# Altium schematic sheet DC_DC_15V_AND_VAR.SchDoc
size Tabloid; Date: Date; Author: Author 1; DocumentNumber: 6; Revision: 1; SheetNumber: 6; SheetTotal: 7; Size: 11x17; Sheet_Name: 15V and Variable V
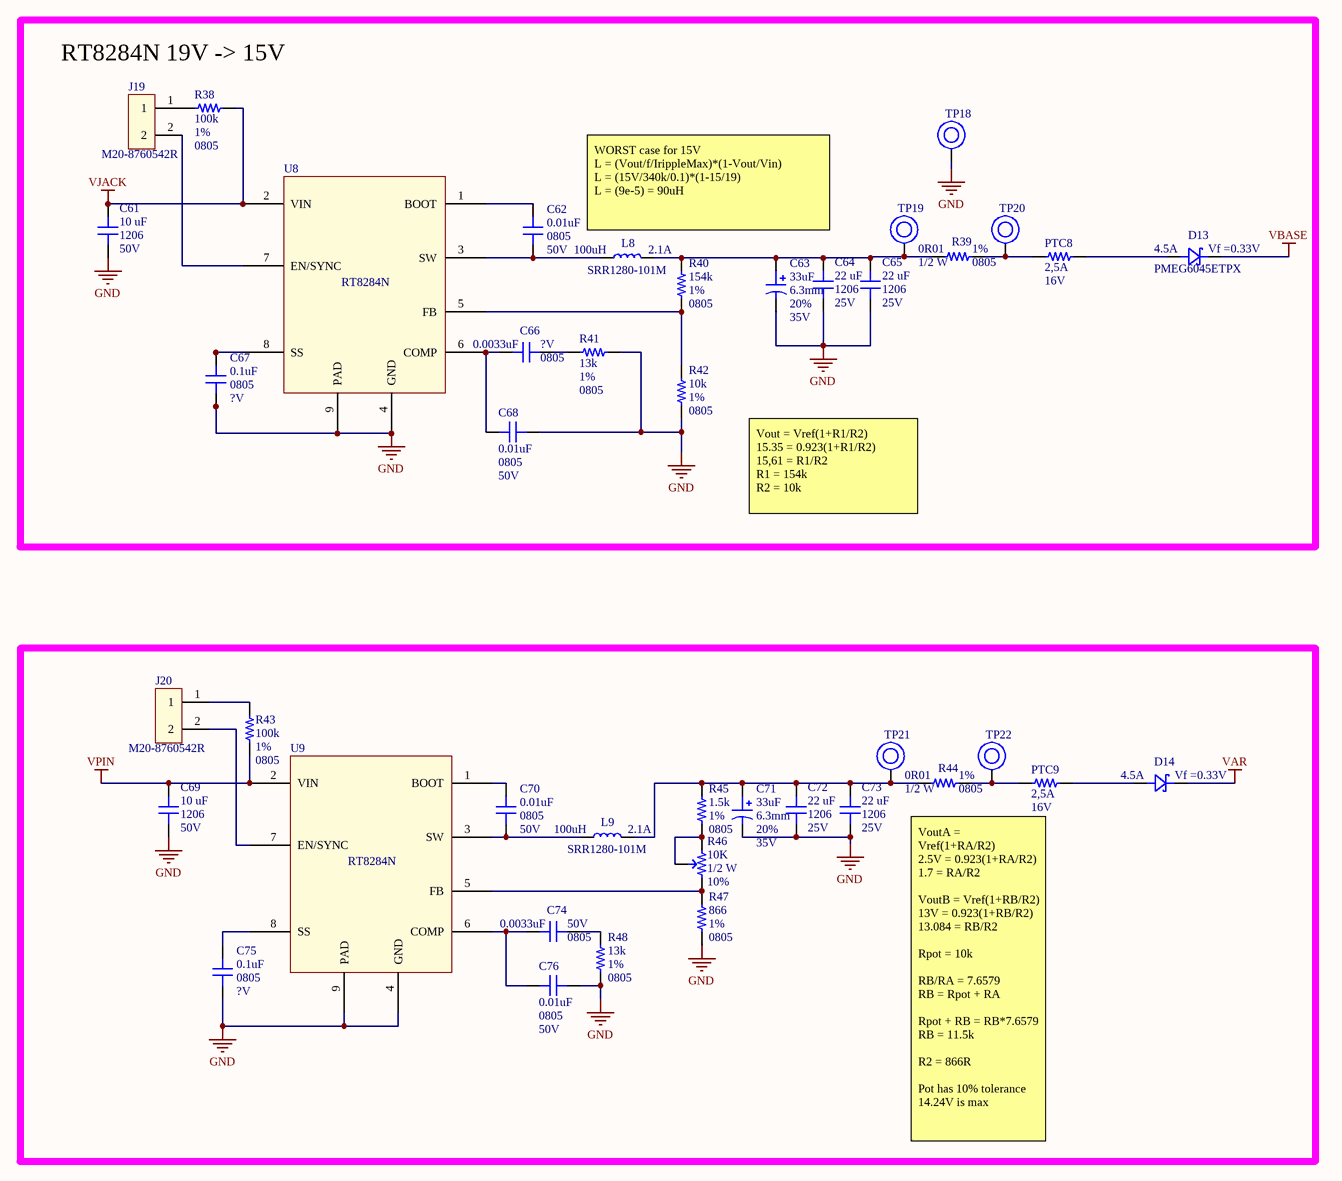
[diagram p0: DC_DC_15V_AND_VAR.SchDoc]

## Parts
C61  value 10 uF  Package: 1206  Voltage: 50V  [CAP_1206]  (hidden comment: CAP - 1206)
C62  value 0.01uF  Package: 0805  Voltage: 50V  [CAP_0805]  (hidden comment: CAP - 0805)
C63  value 33uF  Package: 6.3mm  Tolerance: 20%  Voltage: 35V  [CAP ALU - 6.3mm DIA]  (hidden comment: CAP ALU - 6.3mm)
C64  value 22 uF  Package: 1206  Voltage: 25V  [CAP_1206]  (hidden comment: CAP - 1206)
C65  value 22 uF  Package: 1206  Voltage: 25V  [CAP_1206]  (hidden comment: CAP - 1206)
C66  value 0.0033uF  Package: 0805  Voltage: ?V  [CAP_0805]  (hidden comment: CAP - 0805)
C67  value 0.1uF  Package: 0805  Voltage: ?V  [CAP_0805]  (hidden comment: CAP - 0805)
C68  value 0.01uF  Package: 0805  Voltage: 50V  [CAP_0805]  (hidden comment: CAP - 0805)
C69  value 10 uF  Package: 1206  Voltage: 50V  [CAP_1206]  (hidden comment: CAP - 1206)
C70  value 0.01uF  Package: 0805  Voltage: 50V  [CAP_0805]  (hidden comment: CAP - 0805)
C71  value 33uF  Package: 6.3mm  Tolerance: 20%  Voltage: 35V  [CAP ALU - 6.3mm DIA]  (hidden comment: CAP ALU - 6.3mm)
C72  value 22 uF  Package: 1206  Voltage: 25V  [CAP_1206]  (hidden comment: CAP - 1206)
C73  value 22 uF  Package: 1206  Voltage: 25V  [CAP_1206]  (hidden comment: CAP - 1206)
C74  value 0.0033uF  Package: 0805  Voltage: 50V  [CAP_0805]  (hidden comment: CAP - 0805)
C75  value 0.1uF  Package: 0805  Voltage: ?V  [CAP_0805]  (hidden comment: CAP - 0805)
C76  value 0.01uF  Package: 0805  Voltage: 50V  [CAP_0805]  (hidden comment: CAP - 0805)
D13  Current: 4.5A  Vf: Vf =0.33V  Part number: PMEG6045ETPX  [DO-214AC_SOD128]  (hidden comment: SCHOTTKEY)
D14  Current: 4.5A  Vf: Vf =0.33V  [DO-214AC_SOD128]  (hidden comment: SCHOTTKEY)
J19  Part number: M20-8760542R  [HDR1X2]  (hidden comment: Header 2 pin SM)
J20  Part number: M20-8760542R  [HDR1X2]  (hidden comment: Header 2 pin SM)
L8  value 100uH  Current: 2.1A  Part number: SRR1280-101M  [BOURNS 12.5x12.5mm]  (hidden comment: IND)
L9  value 100uH  Current: 2.1A  Part number: SRR1280-101M  [BOURNS 12.5x12.5mm]  (hidden comment: IND)
PTC8  Trip value: 2,5A  Voltage: 16V  [PTC - 1812]  (hidden comment: PTC - 1812)
PTC9  Trip value: 2,5A  Voltage: 16V  [PTC - 1812]  (hidden comment: PTC - 1812)
R38  value 100k  Tolerance: 1%  Package: 0805  [FER_0805]  (hidden comment: RES - 0805)
R39  value 0R01  Watt: 1/2 W  Tolerance: 1%  Package: 0805  [FER_0805]  (hidden comment: RES - 0805)
R40  value 154k  Tolerance: 1%  Package: 0805  [FER_0805]  (hidden comment: RES - 0805)
R41  value 13k  Tolerance: 1%  Package: 0805  [FER_0805]  (hidden comment: RES - 0805)
R42  value 10k  Tolerance: 1%  Package: 0805  [FER_0805]  (hidden comment: RES - 0805)
R43  value 100k  Tolerance: 1%  Package: 0805  [FER_0805]  (hidden comment: RES - 0805)
R44  value 0R01  Watt: 1/2 W  Tolerance: 1%  Package: 0805  [FER_0805]  (hidden comment: RES - 0805)
R45  value 1.5k  Tolerance: 1%  Package: 0805  [FER_0805]  (hidden comment: RES - 0805)
R46  value 10K  Watt: 1/2 W  Tolerance: 10%  [3361P]  (hidden comment: Pot)
R47  value 866  Tolerance: 1%  Package: 0805  [FER_0805]  (hidden comment: RES - 0805)
R48  value 13k  Tolerance: 1%  Package: 0805  [FER_0805]  (hidden comment: RES - 0805)
TP18  TestPoint 3x3mm  [TestPoint 3X3mm]  (value not drawn)
TP19  TestPoint 3x3mm  [TestPoint 3X3mm]  (value not drawn)
TP20  TestPoint 3x3mm  [TestPoint 3X3mm]  (value not drawn)
TP21  TestPoint 3x3mm  [TestPoint 3X3mm]  (value not drawn)
TP22  TestPoint 3x3mm  [TestPoint 3X3mm]  (value not drawn)
U8  RT8284N  [SOP8]  (value not drawn)
U9  RT8284N  [SOP8]  (value not drawn)

## Blocks framed on the sheet
RT8284N 19V -> 15V: C61-C68 D13 J19 L8 PTC8 R38-R42 TP18-TP20 U8

## Nets
GND: C61.2 C63.2 C64.2 C65.2 C67.2 C68.2 C69.2 C71.2 C72.2 C73.2 C75.2 C76.2 R41.2 R42.2 R47.2 R48.1 TP18.1 U8.4(GND) U8.9(PAD) U9.4(GND) U9.9(PAD)
VAR: D14.2
VBASE: D13.2
VJACK: C61.1 R38.2 U8.2(VIN)
VPIN: C69.1 R43.1 U9.2(VIN)
NetC62_1: C62.1 U8.1(BOOT)
NetC62_2: C62.2 L8.1 U8.3(SW)
NetC63_1: C63.1 C64.1 C65.1 L8.2 R39.1 R40.1 TP19.1
NetC66_1: C66.1 C68.1 U8.6(COMP)
NetC66_2: C66.2 R41.1
NetC67_1: C67.1 U8.8(SS)
NetC70_1: C70.1 U9.1(BOOT)
NetC70_2: C70.2 L9.1 U9.3(SW)
NetC71_1: C71.1 C72.1 C73.1 L9.2 R44.1 R45.1 TP21.1
NetC74_1: C74.1 C76.1 U9.6(COMP)
NetC74_2: C74.2 R48.2
NetC75_1: C75.1 U9.8(SS)
NetD13_1: D13.1 PTC8.2
NetD14_1: D14.1 PTC9.2
NetJ19_1: J19.1 R38.1
NetJ19_2: J19.2 U8.7(EN/SYNC)
NetJ20_1: J20.1 R43.2
NetJ20_2: J20.2 U9.7(EN/SYNC)
NetPTC8_1: PTC8.1 R39.2 TP20.1
NetPTC9_1: PTC9.1 R44.2 TP22.1
NetR40_2: R40.2 R42.1 U8.5(FB)
NetR45_2: R45.2 R46.1 R46.3
NetR46_2: R46.2 R47.1 U9.5(FB)

## Notes on the sheet
- WORST case for 15V
  L = (Vout/f/IrippleMax)*(1-Vout/Vin)
  L = (15V/340k/0.1)*(1-15/19)
  L = (9e-5) = 90uH
- Vout = Vref(1+R1/R2)
  15.35 = 0.923(1+R1/R2)
  15,61 = R1/R2
  R1 = 154k
  R2 = 10k
- VoutA = Vref(1+RA/R2)
  2.5V = 0.923(1+RA/R2)
  1.7 = RA/R2
  VoutB = Vref(1+RB/R2)
  13V = 0.923(1+RB/R2)
  13.084 = RB/R2
  Rpot = 10k
  RB/RA = 7.6579
  RB = Rpot + RA
  Rpot + RB = RB*7.6579
  RB = 11.5k
  R2 = 866R
  Pot has 10% tolerance
  14.24V is max
- Sheet Name
- Project Title
- Global Project
- Size
- Group
- Revision
- Date
- Sheet
- of
- Filename
- Designers

## Library data of the parts
C61 C69 = CAP - 1206: Part number: GRT31CR61H106ME01L
C62 C68 C70 C76 = CAP - 0805: Part number: CL21B103KBANNNC
C63 C71 = CAP ALU - 6_3mm: Part number: EEE-FK1V330P
C64 C65 C72 C73 = CAP - 1206: Part number: CL31A226KAHNNNE
C66 C74 = CAP - 0805: Part number: CL21B332KBANNNC
C67 C75 = CAP - 0805: Part number: CC0805KRX7R9BB104
D14 = SCHOTTKEY: Part number: PMEG6045ETPX
PTC8 PTC9 = PTC - 1812: Part number: 0ZCG0160BF2C; Res: ?; Package: 1812
R38 R43 = RES - 0805: Part number: RMCF0805FT100K; Watt: ? W
R39 R44 = RES - 0805: Part number: KRL1220E-M-R010-F-T5
R40 = RES - 0805: Part number: RC0805FR-07154KL; Watt: ? W
R41 R48 = RES - 0805: Part number: RC0805FR-0713KL; Watt: ? W
R42 = RES - 0805: Part number: RMCF0805FT10K0; Watt: ? W
R45 = RES - 0805: Part number: CRCW08051K50FKEA; Watt: ? W
R46 = Pot: Part number: 3361P-1-103GLF; Package: ?
R47 = RES - 0805: Part number: RC0805FR-07866RL; Watt: ? W
L8 L9 = IND: Package: ?
U8 U9 = RT8284N: Part number: RT8284N